# EAGLE design typewriter_shift (EAGLE 7.2.0)
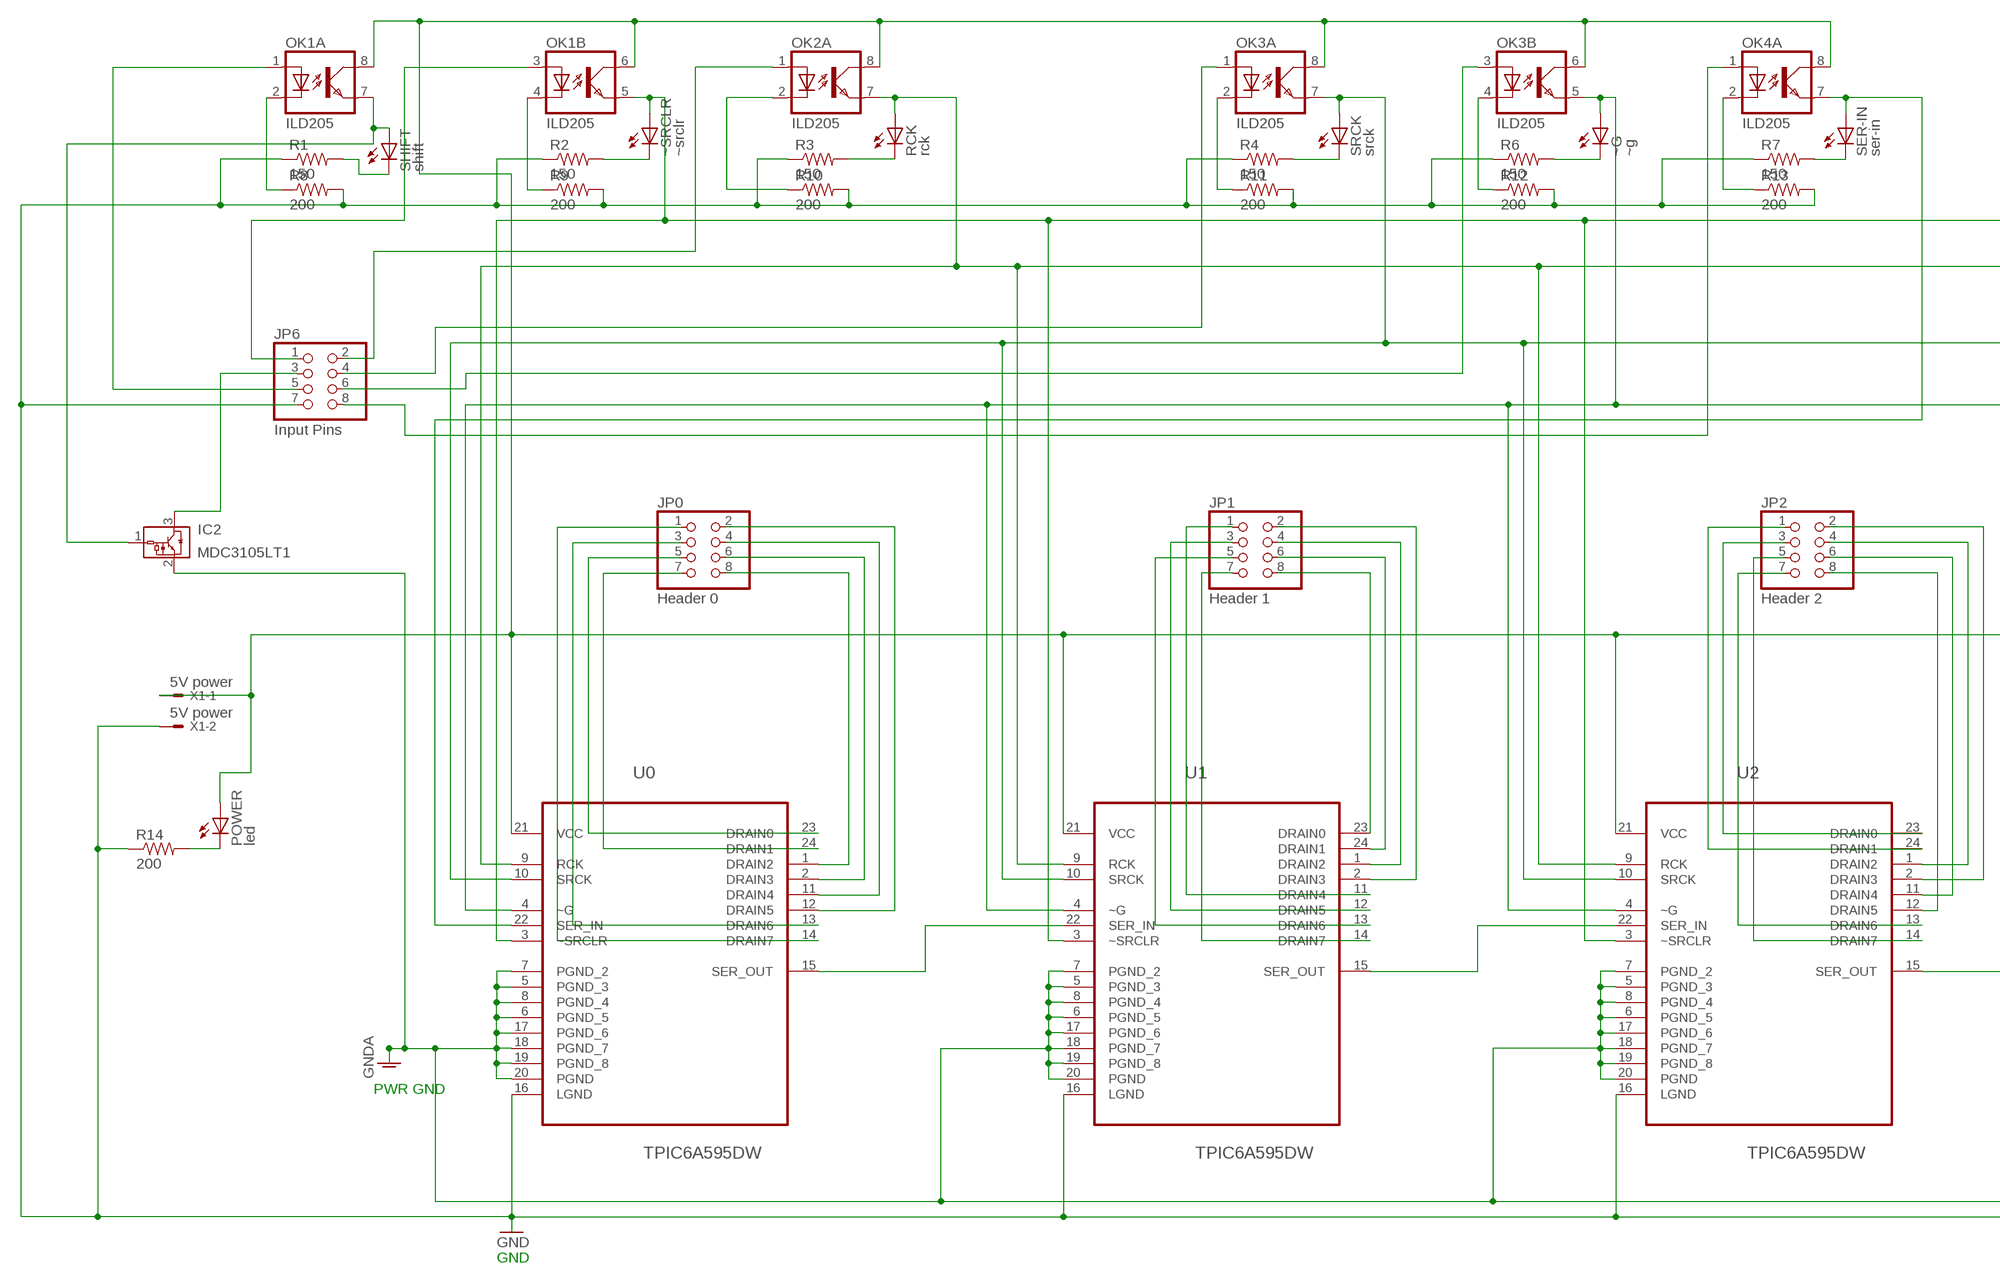
[diagram p0: schematic, sheet 1, part 1 of 2]
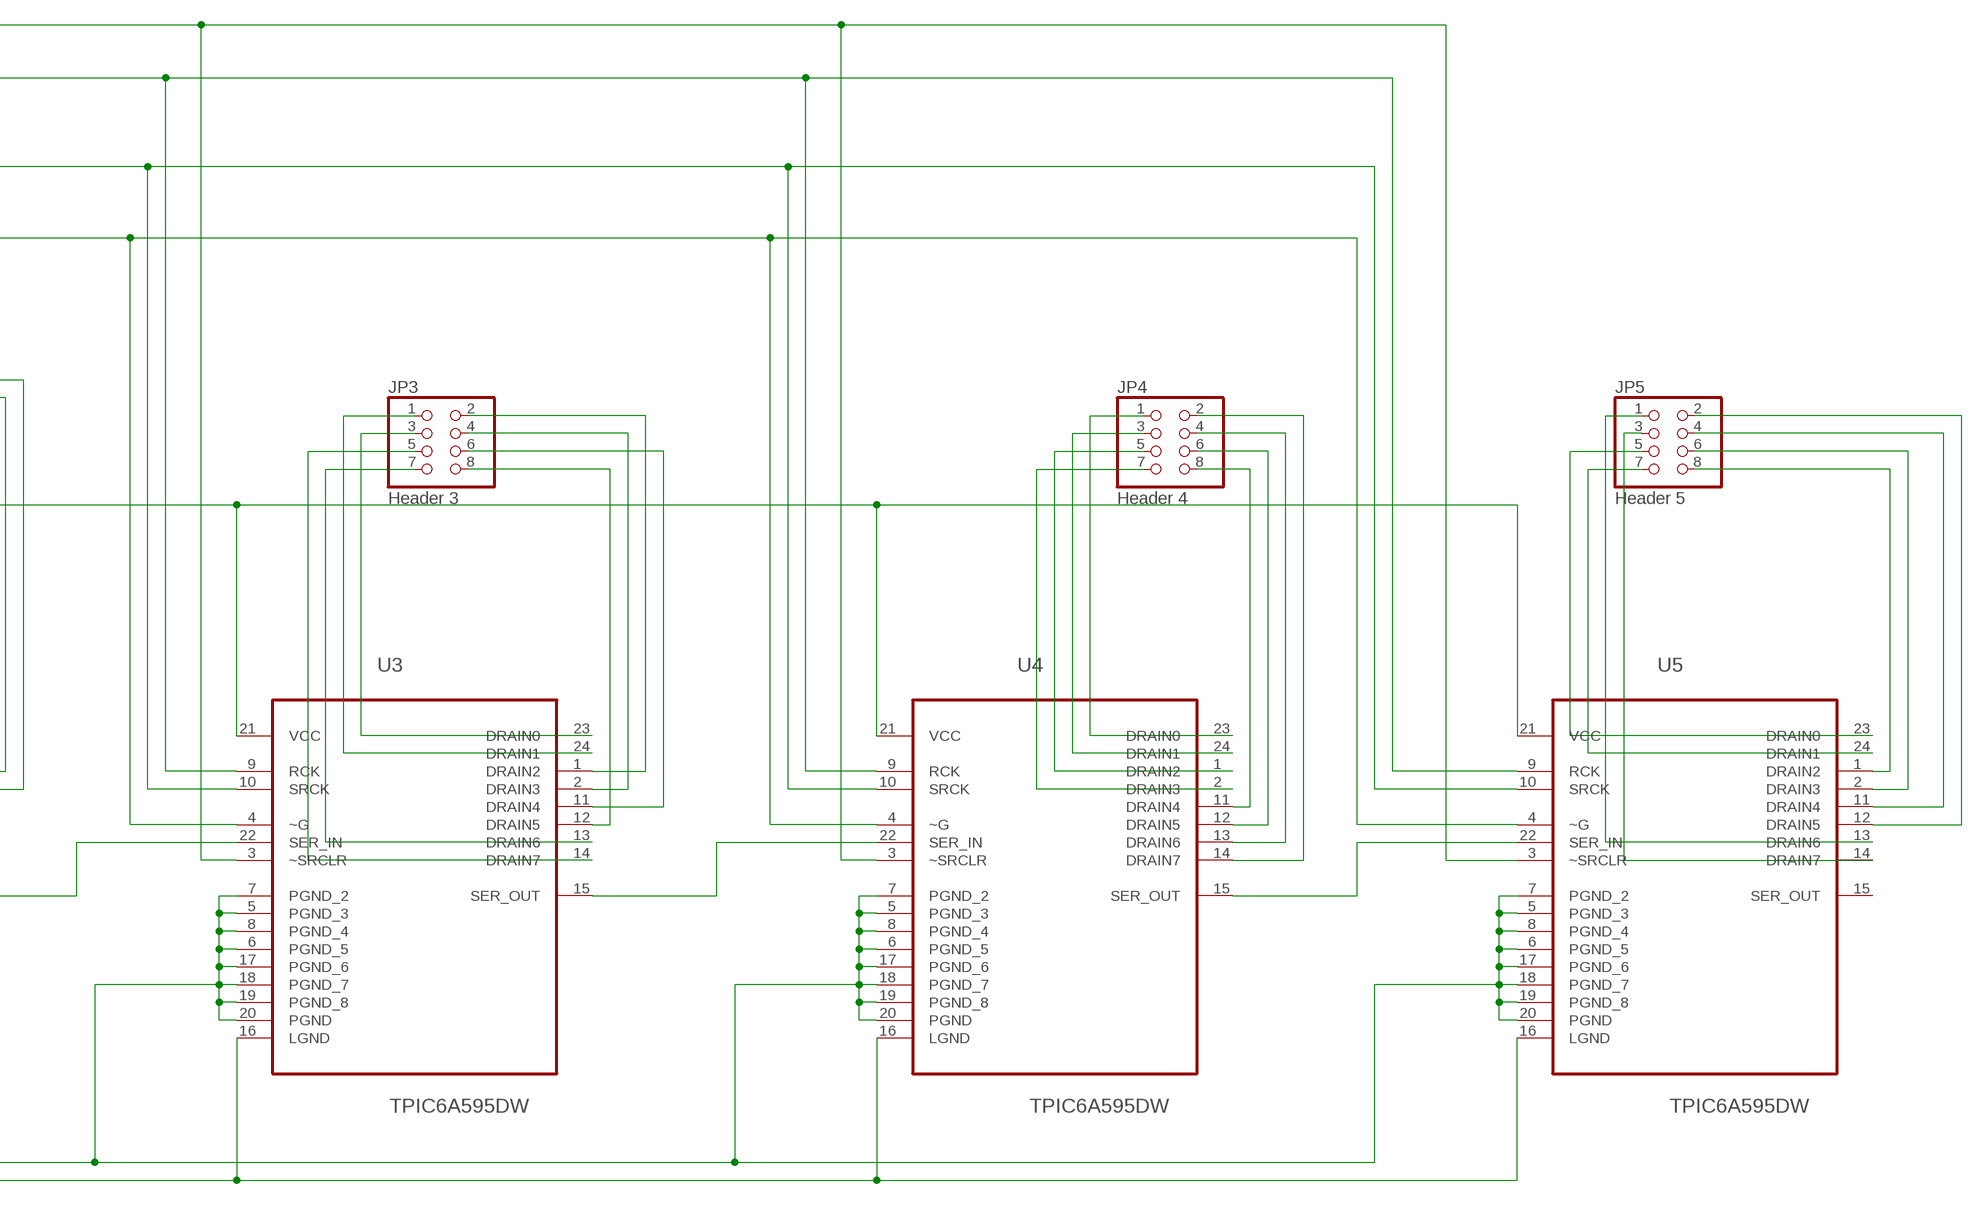
[diagram p1: schematic, sheet 1, part 2 of 2]

## Parts
IC2  MDC3105LT1  [SOT23]
JP0  Header 0  PINHD-2X4/90  [2X04/90]
JP1  Header 1  PINHD-2X4/90  [2X04/90]
JP2  Header 2  PINHD-2X4/90  [2X04/90]
JP3  Header 3  PINHD-2X4/90  [2X04/90]
JP4  Header 4  PINHD-2X4/90  [2X04/90]
JP5  Header 5  PINHD-2X4/90  [2X04/90]
JP6  Input Pins  PINHD-2X4/90  [2X04/90]
OK1  ILD205  [SOIC08]
OK2  ILD205  [SOIC08]
OK3  ILD205  [SOIC08]
OK4  ILD205  [SOIC08]
POWER  led  LEDSML1206  [SML1206]
R1  150  R-US_R1206  [R1206]
R2  150  R-US_R1206  [R1206]
R3  150  R-US_R1206  [R1206]
R4  150  R-US_R1206  [R1206]
R6  150  R-US_R1206  [R1206]
R7  150  R-US_R1206  [R1206]
R8  200  R-US_R1206  [R1206]
R9  200  R-US_R1206  [R1206]
R10  200  R-US_R1206  [R1206]
R11  200  R-US_R1206  [R1206]
R12  200  R-US_R1206  [R1206]
R13  200  R-US_R1206  [R1206]
R14  200  R-US_R1206  [R1206]
RCK  rck  LEDSML1206  [SML1206]
SER-IN  ser-in  LEDSML1206  [SML1206]
SHIFT  shift  LEDSML1206  [SML1206]
SRCK  srck  LEDSML1206  [SML1206]
U0  TPIC6A595DW  [SOIC127P1030X265-24N]
U1  TPIC6A595DW  [SOIC127P1030X265-24N]
U2  TPIC6A595DW  [SOIC127P1030X265-24N]
U3  TPIC6A595DW  [SOIC127P1030X265-24N]
U4  TPIC6A595DW  [SOIC127P1030X265-24N]
U5  TPIC6A595DW  [SOIC127P1030X265-24N]
X1  5V power  KK-156-2  [KK-156-2]
~G  ~g  LEDSML1206  [SML1206]
~SRCLR  ~srclr  LEDSML1206  [SML1206]

## Nets
GND: JP6.7 R1.1 R2.1 R3.1 R4.1 R6.1 R7.1 R8.2 R9.2 R10.2 R11.2 R12.2 R13.2 R14.1 U0.16(LGND) U1.16(LGND) U2.16(LGND) U3.16(LGND) U4.16(LGND) U5.16(LGND) X1.2
GNDA [PWR Ground]: IC2.2(GND) U0.5(PGND_3) U0.6(PGND_5) U0.7(PGND_2) U0.8(PGND_4) U0.17(PGND_6) U0.18(PGND_7) U0.19(PGND_8) U0.20(PGND) U1.5(PGND_3) U1.6(PGND_5) U1.7(PGND_2) U1.8(PGND_4) U1.17(PGND_6) U1.18(PGND_7) U1.19(PGND_8) U1.20(PGND) U2.5(PGND_3) U2.6(PGND_5) U2.7(PGND_2) U2.8(PGND_4) U2.17(PGND_6) U2.18(PGND_7) U2.19(PGND_8) U2.20(PGND) U3.5(PGND_3) U3.6(PGND_5) U3.7(PGND_2) U3.8(PGND_4) U3.17(PGND_6) U3.18(PGND_7) U3.19(PGND_8) U3.20(PGND) U4.5(PGND_3) U4.6(PGND_5) U4.7(PGND_2) U4.8(PGND_4) U4.17(PGND_6) U4.18(PGND_7) U4.19(PGND_8) U4.20(PGND) U5.5(PGND_3) U5.6(PGND_5) U5.7(PGND_2) U5.8(PGND_4) U5.17(PGND_6) U5.18(PGND_7) U5.19(PGND_8) U5.20(PGND)
N$1: U0.15(SER_OUT) U1.22(SER_IN)
N$2: U1.15(SER_OUT) U2.22(SER_IN)
N$3: U2.15(SER_OUT) U3.22(SER_IN)
N$4: U3.15(SER_OUT) U4.22(SER_IN)
N$5: U4.15(SER_OUT) U5.22(SER_IN)
N$6: R3.2 RCK.C
N$7: OK4.7(A:EMIT) SER-IN.A U0.22(SER_IN)
N$8: R2.2 ~SRCLR.C
N$9 [PWR Ground]: JP0.7 U0.24(DRAIN1)
N$11: JP6.5 OK1.1(A:A)
N$12 [PWR Ground]: JP0.5 U0.23(DRAIN0)
N$13 [PWR Ground]: JP0.8 U0.1(DRAIN2)
N$14 [PWR Ground]: JP0.6 U0.2(DRAIN3)
N$15 [PWR Ground]: IC2.3(VOUT) JP6.3
N$16: IC2.1(VIN) OK1.7(A:EMIT) SHIFT.A
N$17: OK1.2(A:C) R8.1
N$18 [PWR Ground]: JP0.4 U0.11(DRAIN4)
N$19 [PWR Ground]: JP0.2 U0.12(DRAIN5)
N$20: JP6.1 OK1.3(B:A)
N$21 [PWR Ground]: JP0.3 U0.13(DRAIN6)
N$22 [PWR Ground]: JP0.1 U0.14(DRAIN7)
N$23: JP6.2 OK2.1(A:A)
N$24 [PWR Ground]: JP1.4 U1.1(DRAIN2)
N$25 [PWR Ground]: JP1.6 U1.24(DRAIN1)
N$26 [PWR Ground]: JP1.8 U1.23(DRAIN0)
N$27 [PWR Ground]: JP1.2 U1.2(DRAIN3)
N$28 [PWR Ground]: JP1.1 U1.11(DRAIN4)
N$29: JP6.4 OK3.1(A:A)
N$30: JP6.8 OK4.1(A:A)
N$31: JP6.6 OK3.3(B:A)
N$32: OK3.4(B:C) R12.1
N$33: JP1.7 U1.14(DRAIN7)
N$34 [PWR Ground]: JP1.3 U1.12(DRAIN5)
N$35 [PWR Ground]: JP1.5 U1.13(DRAIN6)
N$36 [PWR Ground]: JP3.3 U3.23(DRAIN0)
N$37 [PWR Ground]: JP2.6 U2.11(DRAIN4)
N$38 [PWR Ground]: JP2.4 U2.1(DRAIN2)
N$39: JP2.2 U2.2(DRAIN3)
N$40 [PWR Ground]: JP2.5 U2.14(DRAIN7)
N$41 [PWR Ground]: JP2.7 U2.13(DRAIN6)
N$42: JP2.3 U2.23(DRAIN0)
N$43 [PWR Ground]: JP2.1 U2.24(DRAIN1)
N$44 [PWR Ground]: JP2.8 U2.12(DRAIN5)
N$45 [PWR Ground]: JP3.1 U3.24(DRAIN1)
N$46 [PWR Ground]: JP3.2 U3.1(DRAIN2)
N$47 [PWR Ground]: JP3.4 U3.2(DRAIN3)
N$48 [PWR Ground]: JP3.6 U3.11(DRAIN4)
N$49 [PWR Ground]: JP3.8 U3.12(DRAIN5)
N$50 [PWR Ground]: JP3.7 U3.13(DRAIN6)
N$51 [PWR Ground]: JP3.5 U3.14(DRAIN7)
N$52 [PWR Ground]: JP4.1 U4.23(DRAIN0)
N$53 [PWR Ground]: JP4.3 U4.24(DRAIN1)
N$54 [PWR Ground]: JP4.5 U4.1(DRAIN2)
N$55 [PWR Ground]: JP4.7 U4.2(DRAIN3)
N$56 [PWR Ground]: JP4.8 U4.11(DRAIN4)
N$57 [PWR Ground]: JP4.6 U4.12(DRAIN5)
N$58 [PWR Ground]: JP4.4 U4.13(DRAIN6)
N$59 [PWR Ground]: JP4.2 U4.14(DRAIN7)
N$60 [PWR Ground]: JP5.5 U5.23(DRAIN0)
N$61 [PWR Ground]: JP5.7 U5.24(DRAIN1)
N$62 [PWR Ground]: JP5.8 U5.1(DRAIN2)
N$63 [PWR Ground]: JP5.6 U5.2(DRAIN3)
N$64 [PWR Ground]: JP5.4 U5.11(DRAIN4)
N$65 [PWR Ground]: JP5.2 U5.12(DRAIN5)
N$66 [PWR Ground]: JP5.1 U5.13(DRAIN6)
N$67: JP5.3 U5.14(DRAIN7)
N$68: OK3.5(B:EMIT) U0.4(~G) U1.4(~G) U2.4(~G) U3.4(~G) U4.4(~G) U5.4(~G) ~G.A
N$69: OK3.7(A:EMIT) SRCK.A U0.10(SRCK) U1.10(SRCK) U2.10(SRCK) U3.10(SRCK) U4.10(SRCK) U5.10(SRCK)
N$70: OK2.7(A:EMIT) RCK.A U0.9(RCK) U1.9(RCK) U2.9(RCK) U3.9(RCK) U4.9(RCK) U5.9(RCK)
N$71: OK1.5(B:EMIT) U0.3(~SRCLR) U1.3(~SRCLR) U2.3(~SRCLR) U3.3(~SRCLR) U4.3(~SRCLR) U5.3(~SRCLR) ~SRCLR.A
N$72: OK4.2(A:C) R13.1
N$73: R1.2 SHIFT.C
N$74: R4.2 SRCK.C
N$75: R6.2 ~G.C
N$76: OK3.2(A:C) R11.1
N$77: OK2.2(A:C) R10.1
N$78: OK1.4(B:C) R9.1
N$79: R7.2 SER-IN.C
N$80: POWER.C R14.2
VCC: OK1.6(B:COL) OK1.8(A:COL) OK2.8(A:COL) OK3.6(B:COL) OK3.8(A:COL) OK4.8(A:COL) POWER.A U0.21(VCC) U1.21(VCC) U2.21(VCC) U3.21(VCC) U4.21(VCC) U5.21(VCC) X1.1
Unconnected: OK2.3(B:A) OK2.4(B:C) OK2.5(B:EMIT) OK2.6(B:COL) OK4.3(B:A) OK4.4(B:C) OK4.5(B:EMIT) OK4.6(B:COL) U5.15(SER_OUT)

## Notes on the sheet
- PWR GND
- GND

## Library data of the parts
IC2 = on-semiconductor:MDC3105LT1: Integrated Relay, Inductive Load Driver Sopurce: U6 OnSemi Inductive Load Driver MDC3105-D.PDF; MF: ON SEMICONDUCTOR; MPN: MDC3105LT1; OC_FARNELL: 1126459; OC_NEWARK: 16F6132
JP0 JP1-JP6 = pinhead:PINHD-2X4: PIN HEADER
OK1-OK4 = optocoupler:ILD2*: Siemens ILD205/206/207/211/213/217 DUAL PHOTOTRANSISTOR SMALL OUTLINE SURFACE MOUNT OPTOCOUPLER Source: 153385-da-01-en-Optocoupler_ILD205-T.pdf; MF: VISHAY/TELEFUNKEN; MPN: ILD205T; OC_FARNELL: 1469512; OC_NEWARK: 20H8678
POWER RCK SER-IN SHIFT SRCK ~G ~SRCLR = led:LED: LED OSRAM: - CHIPLED LG R971, LG N971, LY N971, LG Q971, LY Q971, LO R971, LY R971 LH N974, LH R974 LS Q976, LO Q976, LY Q976 LO Q996 - Hyper CHIPLED LW Q18S LB Q993, LB Q99A, LB R99A - SideLED LS A670, LO A670, LY A670, LG A670, LP A670 LB A673, LV A673, LT A673, LW A673 LH A674 LY A675 LS A676, LA A676, LO A676, LY A676, LW A676 LS A679, LY A679, LG A679 - Hyper Micro SIDELED® LS Y876, LA Y876, LO Y876, LY Y876 LT Y87S - SmartLED LW L88C, LW L88S LB L89C, LB L89S, LG L890 LS L89K, LO L89K, LY L89K LS L896, LA L896, LO L896, LY L896 - TOPLED LS T670, LO T670, LY T670, LG T670, LP T670 LSG T670, LSP T670, LSY T670, LOP T670, LYG T670 LG T671, LOG T671, LSG T671 LB T673, LV T673, LT T673, LW T673 LH T674 LS T676, LA T676, LO T676, LY T676, LB T676, LH T676, LSB T676, LW T676 LB T67C, LV T67C, LT T67C, LS T67K, LO T67K, LY T67K, LW E67C LS E67B, LA E67B, LO E67B, LY E67B, LB E67C, LV E67C, LT E67C LW T67C LS T679, LY T679, LG T679 LS T770, LO T770, LY T770, LG T770, LP T770 LB T773, LV T773, LT T773, LW T773 LH T774 LS E675, LA E675, LY E675, LS T675 LS T776, LA T776, LO T776, LY T776, LB T776 LHGB T686 LT T68C, LB T68C - Hyper Mini TOPLED® LB M676 - Mini TOPLED Santana® LG M470 LS M47K, LO M47K, LY M47K Source: http://www.osram.convergy.de LUXEON: - LUMILED® LXK2-PW12-R00, LXK2-PW12-S00, LXK2-PW14-U00, LXK2-PW14-V00 LXK2-PM12-R00, LXK2-PM12-S00, LXK2-PM14-U00 LXK2-PE12-Q00, LXK2-PE12-R00, LXK2-PE12-S00, LXK2-PE14-T00, LXK2-PE14-U00 LXK2-PB12-K00, LXK2-PB12-L00, LXK2-PB12-M00, LXK2-PB14-N00, LXK2-PB14-P00, LXK2-PB14-Q00 LXK2-PR12-L00, LXK2-PR12-M00, LXK2-PR14-Q00, LXK2-PR14-R00 LXK2-PD12-Q00, LXK2-PD12-R00, LXK2-PD12-S00 LXK2-PH12-R00, LXK2-PH12-S00 LXK2-PL12-P00, LXK2-PL12-Q00, LXK2-PL12-R00 Source: www.luxeon.com KINGBRIGHT: KA-3528ASYC Source: www.kingbright.com
R1-R4 R6-R14 = resistor:R-US_: RESISTOR, American symbol
U0 U1-U5 = Texas Instruments_By_element14_Batch_1:TPIC6A595DW: POWER LOGIC 8-BIT SHIFT REGISTER; MPN: TPIC6A595DW; OC_FARNELL: -; OC_NEWARK: 83F9188; PACKAGE: SOIC-24; SUPPLIER: Texas Instruments
X1 = con-molex:KK-156-2: KK 156 HEADER Source: http://www.molex.com/pdm_docs/sd/026604100_sd.pdf; OC_FARNELL: unknown; OC_NEWARK: unknown

## Net classes
1 PWR Ground: width 0.61 mm, drill 0.61 mm

## Board
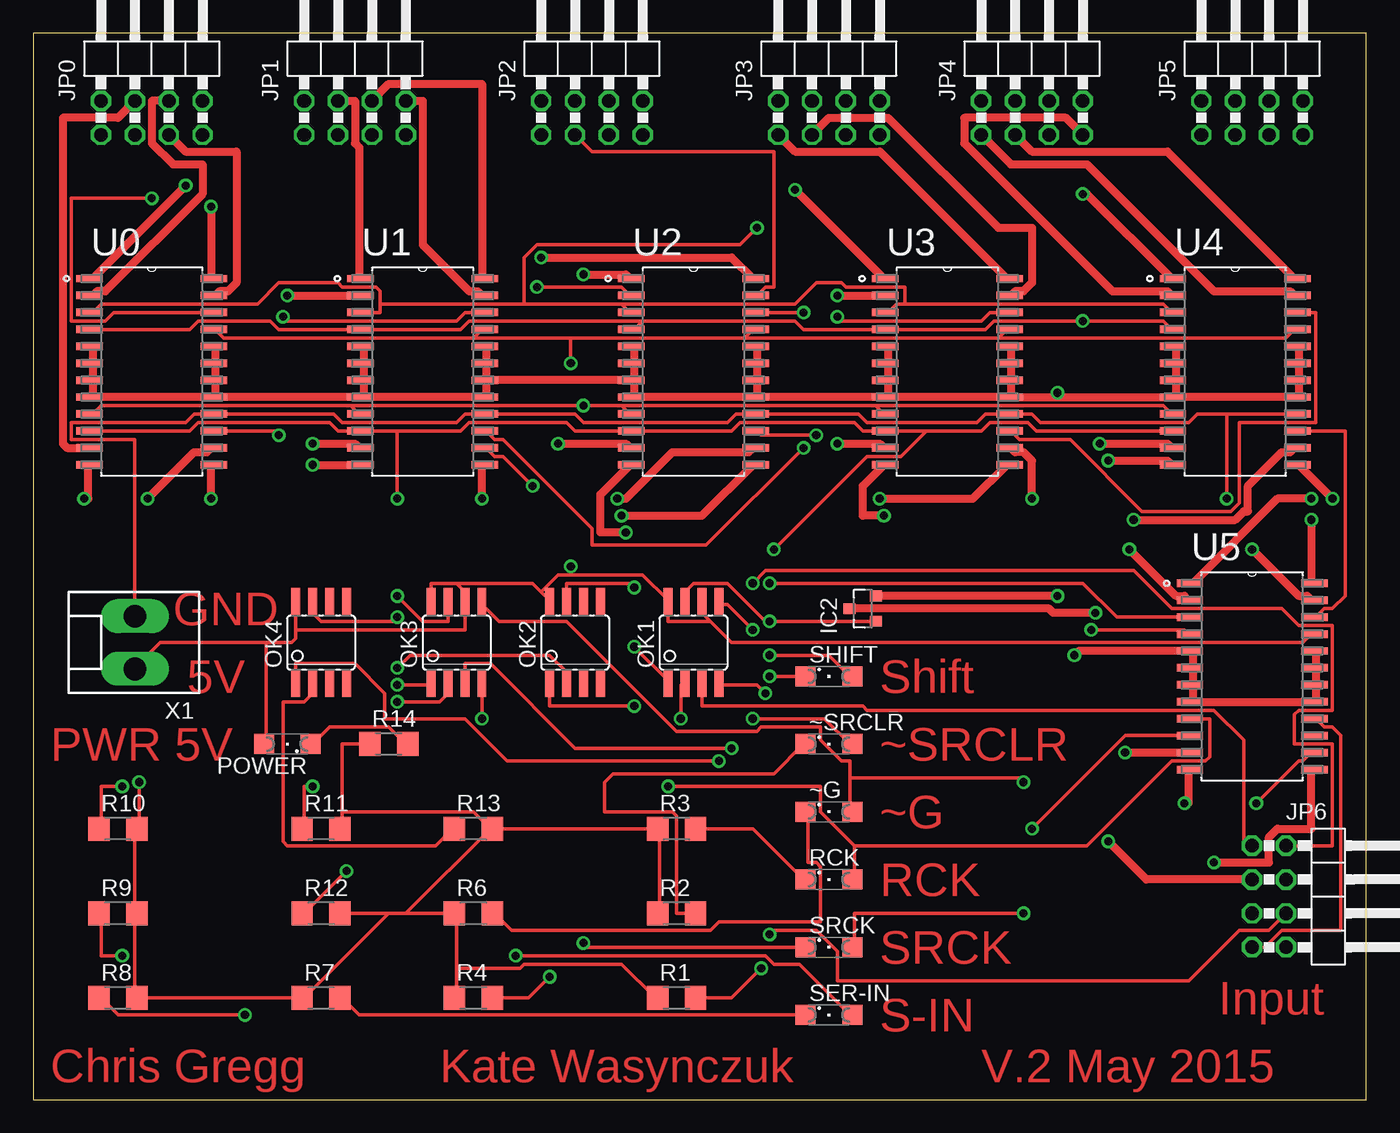
[diagram p2: board, top side]
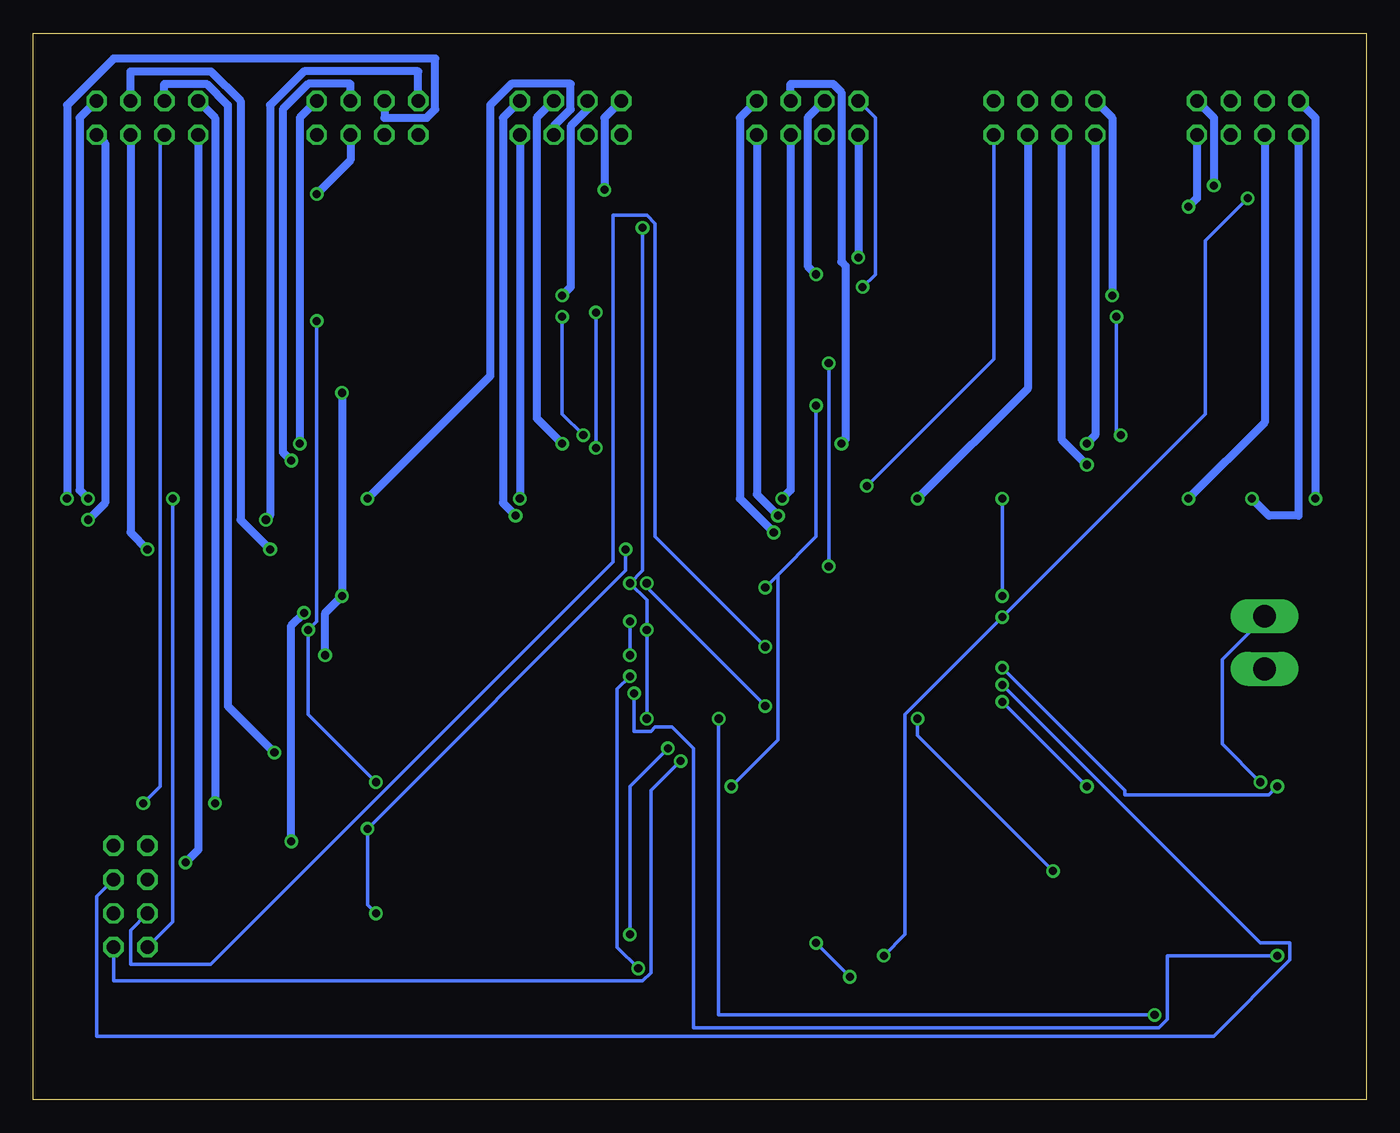
[diagram p3: board, bottom side, seen from below]

Size 100 x 80 mm. Coordinates in mm from the lower left corner, seen from the top.
Outline: 0,0 100,0 100,80 0,80 0,0
Copper layers (1*16): Top 0.035mm / dielectric 1.5mm / Bottom 0.035mm
Design rules "default": minimum track width 10mil, minimum drill 24mil, track to track 8mil, track to pad 8mil, pad to pad 8mil, via to via 8mil, smd to smd 8mil, copper to edge 40mil, drill to drill 8mil, minimum pad ring 10mil, minimum via ring 8mil, stop-mask expansion 4mil, vias tented up to drill 0mil, thermal gap 10mil
vRestrict: area 1.3,45.7 to 16.5,63.5; area 21.6,45.7 to 36.8,63.5; area 41.9,45.7 to 57.2,63.5; area 61,45.7 to 76.2,63.5; area 81.3,45.7 to 97.8,63.5; area 82.6,22.9 to 99.1,40.6; area 55.9,5.1 to 73.7,39.4; area 1.3,17.8 to 11.4,22.9; area 1.3,11.4 to 11.4,16.5; area 1.3,5.1 to 11.4,10.2; area 16.5,5.1 to 26.7,10.2; area 16.5,11.4 to 26.7,16.5; 12 more areas

### Footprints (pad centres in the part's own frame; a part is rotated, then mirrored left to right if it is on the bottom)
SOT23 = smd 0.8 x 0.9: 1 -0.95,-1; 2 0.95,-1; 3 0,1
2X04/90 = drill 1.016 octagon: 1 -3.81,-6.35; 2 -3.81,-3.81; 3 -1.27,-6.35; 4 -1.27,-3.81; 5 1.27,-6.35; 6 1.27,-3.81; 7 3.81,-6.35; 8 3.81,-3.81
SOIC08 = smd 0.66 x 2.032: 1 -1.905,-3.073; 2 -0.635,-3.073; 3 0.635,-3.073; 4 1.905,-3.073; 5 1.905,3.073; 6 0.635,3.073; 7 -0.635,3.073; 8 -1.905,3.073
SML1206 = smd 1.5 x 1.5: A 1.75,0; C -1.75,0
R1206 = smd 1.6 x 1.803: 1 -1.422,0; 2 1.422,0
SOIC127P1030X265-24N = smd 1.981 x 0.559: 1 -4.674,6.985; 2 -4.674,5.715; 3 -4.674,4.445; 4 -4.674,3.175; 5 -4.674,1.905; 6 -4.674,0.635; 7 -4.674,-0.635; 8 -4.674,-1.905; 9 -4.674,-3.175; 10 -4.674,-4.445; 11 -4.674,-5.715; 12 -4.674,-6.985; 13 4.674,-6.985; 14 4.674,-5.715; 15 4.674,-4.445; 16 4.674,-3.175; 17 4.674,-1.905; 18 4.674,-0.635; 19 4.674,0.635; 20 4.674,1.905; 21 4.674,3.175; 22 4.674,4.445; 23 4.674,5.715; 24 4.674,6.985
KK-156-2 = drill 1.7 pad 2.184 long: 1 -1.98,0; 2 1.98,0

### Placement (x,y rotation side)
IC2  62.23,36.83 90 top
JP0  8.89,78.74 0 top
JP1  24.13,78.74 0 top
JP2  41.91,78.74 0 top
JP3  59.69,78.74 0 top
JP4  74.93,78.74 0 top
JP5  91.44,78.74 0 top
JP6  97.79,15.24 270 top
OK1  49.53,34.29 0 top
OK2  40.64,34.29 0 top
OK3  31.75,34.29 0 top
OK4  21.59,34.29 0 top
POWER  19.05,26.67 180 top
R1  48.26,7.62 0 top
R2  48.26,13.97 0 top
R3  48.26,20.32 0 top
R4  33.02,7.62 0 top
R6  33.02,13.97 0 top
R7  21.59,7.62 0 top
R8  6.35,7.62 0 top
R9  6.35,13.97 0 top
R10  6.35,20.32 0 top
R11  21.59,20.32 0 top
R12  21.59,13.97 0 top
R13  33.02,20.32 0 top
R14  26.67,26.67 0 top
RCK  59.69,16.51 0 top
SER-IN  59.69,6.35 0 top
SHIFT  59.69,31.75 0 top
SRCK  59.69,11.43 0 top
U0  8.89,54.61 0 top
U1  29.21,54.61 0 top
U2  49.53,54.61 0 top
U3  68.58,54.61 0 top
U4  90.17,54.61 0 top
U5  91.44,31.75 0 top
X1  7.62,34.29 90 top
~G  59.69,21.59 0 top
~SRCLR  59.69,26.67 0 top

### Tracks (layer width: path | path; a pad name or v marks a point on that pad's centre or on a via)
GND  (via drill 0.61)
  Top 0.254: 7.62,13.97 7.62,7.62 R8.2 R7.1 20.32,7.62 26.67,13.97 | 7.62,13.97 7.62,20.32 R10.2 7.94,20.32 v7.94,23.81 | 7.62,13.97 R9.2 | 23.18,21.59 23.18,26.67 R14.1 | 23.18,21.59 23.18,20.32 R11.2 | R2.1 46.99,13.97 46.99,20.32 R3.1 R13.2 34.29,20.32 | 31.75,9.84 31.75,13.97 R6.1 27.94,13.97 | 31.75,9.84 31.75,7.62 R4.1 | 31.75,9.84 36.51,9.84 36.83,10.16 44.13,10.16 46.67,7.62 R1.1 | 27.94,13.97 26.67,13.97 | 26.67,13.97 R12.2 | 27.94,13.97 34.29,20.32 | 23.18,21.59 33.02,21.59 34.29,20.32 | X1.2 7.62,49.53 2.86,49.53 2.86,50.8 11.43,50.8 12.06,51.44 U0.16 22.54,51.44 23.18,50.8 31.75,50.8 32.38,51.44 U1.16 40.64,51.44 41.27,50.8 52.07,50.8 52.7,51.44 U2.16 61.91,51.44 62.55,50.8 70.8,50.8 71.44,51.44 U3.16 74.93,51.44 75.56,50.8 86.68,50.8 87.31,51.44 89.53,51.44 | JP6.7 92.39,11.43 93.66,12.7 98.11,12.7 98.11,27.3 97.47,27.94 96.84,27.94 96.2,28.57 U5.16 | 89.53,51.44 U4.16 | 89.53,51.44 v89.53,45.09
  Bottom 0.254: JP6.7 89.53,13.34 v89.53,45.09 | v7.94,23.81 10.79,26.67 10.79,33.02 7.62,36.2 X1.2
GNDA  (via drill 0.61)
  Top 0.61: 96.2,31.11 96.2,29.84 U5.17 87,29.84 | 96.2,32.38 96.2,33.66 U5.20 | 96.2,32.38 96.2,31.11 | 96.2,31.11 U5.18 | 96.2,32.38 U5.19 | 87,31.11 87,29.84 | v76.83,37.78 63.5,37.78 IC2.2 | v78.11,33.34 78.42,33.66 U5.5 87,33.66 87,32.38 | 87,32.38 87,31.11 | 87,31.11 U5.7 | 87,32.38 U5.6 | 87,29.84 U5.8 | 4.45,53.98 4.45,52.7 | 4.45,55.24 4.45,56.52 U0.5 | 4.45,55.24 4.45,53.98 | 4.45,53.98 U0.7 | 4.45,55.24 U0.6 | 13.65,53.98 13.65,52.7 | 13.65,55.24 13.65,56.52 U0.20 | 13.65,55.24 13.65,53.98 | 13.65,53.98 U0.18 | 13.65,55.24 U0.19 | 4.45,52.7 U0.17 13.65,52.7 | 4.45,52.7 U0.8 | 24.77,53.98 24.77,52.7 | 24.77,55.24 24.77,56.52 U1.5 | 24.77,55.24 24.77,53.98 | 24.77,53.98 U1.7 | 24.77,55.24 U1.6 | 33.97,53.98 33.97,52.7 U1.17 24.77,52.7 | 33.97,55.24 33.97,56.52 U1.20 | 33.97,55.24 33.97,53.98 | 33.97,55.24 U1.19 | 24.77,52.7 U1.8 13.65,52.7 | 85.72,53.98 85.72,52.7 | 85.72,55.24 85.72,56.52 U4.5 | 85.72,55.24 85.72,53.98 | 85.72,53.98 U4.7 | 85.72,55.24 U4.6 | 94.93,53.98 94.93,52.7 U4.17 85.72,52.7 | 94.93,55.24 94.93,56.52 U4.20 | 94.93,55.24 94.93,53.98 | 94.93,53.98 U4.18 | 94.93,55.24 U4.19 | 85.72,52.7 U4.8 76.83,52.7 | 45.09,53.98 45.09,52.7 | 45.09,55.24 45.09,56.52 U2.5 | 45.09,55.24 45.09,53.98 | 45.09,53.98 U2.7 33.97,53.98 | 45.09,55.24 U2.6 | 54.29,53.98 54.29,52.7 | 54.29,55.24 54.29,56.52 U2.20 | 54.29,55.24 54.29,53.98 | 54.29,53.98 U2.18 | 54.29,55.24 U2.19 | 45.09,52.7 U2.17 54.29,52.7 | 45.09,52.7 U2.8 | 64.14,53.98 64.14,52.7 | 64.14,55.24 64.14,56.52 U3.5 | 64.14,55.24 64.14,53.98 | 64.14,53.98 U3.7 | 64.14,55.24 U3.6 | 73.34,53.98 73.34,52.7 | 73.34,55.24 73.34,56.52 U3.20 | 73.34,55.24 73.34,53.98 | 73.34,53.98 U3.18 | 73.34,55.24 U3.19 | 64.14,52.7 U3.17 73.34,52.7
  Top 0.61: 64.14,52.7 U3.8 54.29,52.7 | 73.34,52.7 76.83,52.7 | 33.97,53.98 U1.18 | 76.83,52.7 v76.83,53.02
  Bottom 0.61: v78.11,33.34 78.11,36.51 v76.83,37.78 v76.83,53.02
N$1  (via drill 0.61)
  Top 0.254: U0.15 18.1,50.16 v18.41,49.85 | v18.73,58.74 19.05,58.42 31.75,58.42 32.38,59.05 U1.22
  Bottom 0.254: v18.41,49.85 18.73,50.16 v18.73,58.74
N$2  (via drill 0.61)
  Top 0.254: v57.78,48.9 50.48,41.59 41.91,41.59 41.91,42.86 35.24,49.53 34.61,49.53 33.97,50.16 U1.15 | U2.22 v57.78,59.05
  Bottom 0.254: v57.78,59.05 v57.78,48.9
N$3  (via drill 0.61)
  Top 0.254: v58.74,49.85 54.61,49.85 54.29,50.16 U2.15 | v60.33,58.74 60.64,58.42 71.12,58.42 71.75,59.05 U3.22
  Bottom 0.254: v58.74,49.85 60.33,51.44 v60.33,58.74
N$4
  Top 0.254: U4.22 96.2,59.05 96.2,50.8 90.49,50.8 90.49,44.77 89.85,44.13 83.19,44.13 77.79,49.53 73.98,49.53 73.34,50.16 U3.15
N$5
  Top 0.254: U4.15 98.42,50.16 98.42,37.78 97.47,36.83 96.84,36.83 96.2,36.2 U5.22
N$6
  Top 0.254: R3.2 53.98,20.32 57.78,16.51 RCK.C
N$7  (via drill 0.61)
  Top 0.254: v36.2,10.79 54.93,10.79 55.56,10.16 57.47,10.16 61.28,6.35 SER-IN.A | v27.3,36.2 26.99,35.88 21.59,35.88 20.95,36.51 OK4.7 | U0.22 6.03,59.05 5.4,58.42 2.86,58.42 2.86,67.63 v8.89,67.63
  Bottom 0.254: v36.2,10.79 34.61,12.38 34.61,28.89 v27.3,36.2 12.06,51.44 12.06,64.45 v8.89,67.63
N$8
  Top 0.254: R2.2 48.26,13.97 48.26,21.27 47.94,21.59 42.86,21.59 42.86,23.81 43.5,24.45 55.56,24.45 57.78,26.67 ~SRCLR.C
N$9  (via drill 0.61)
  Top 0.61: v13.34,66.99 13.34,61.59 U0.24
  Bottom 0.61: v13.34,66.99 12.7,67.63 JP0.7
N$11  (via drill 0.61)
  Top 0.254: v45.09,33.97 47.62,31.43 OK1.1
  Bottom 0.254: v45.09,33.97 53.34,42.23 53.34,65.72 53.98,66.36 56.52,66.36 56.52,40.32 86.68,10.16 92.71,10.16 92.71,12.7 JP6.5
N$12
  Top 0.61: JP0.5 11.43,71.12 15.24,71.12 15.24,61.28 14.61,60.64 13.97,60.64 13.65,60.33 U0.23
N$13  (via drill 0.61)
  Top 0.61: v11.43,68.58 4.45,61.59 U0.1
  Bottom 0.61: v11.43,68.58 11.43,73.66 JP0.8
N$14
  Top 0.61: JP0.6 8.89,74.93 8.89,71.75 10.48,70.17 12.7,70.17 12.7,67.94 5.4,60.64 4.76,60.64 4.45,60.33 U0.2
N$15  (via drill 0.61)
  Top 0.61: IC2.3 76.2,36.83 76.52,36.51 v79.69,36.51 | v80.64,19.37 83.5,16.51 JP6.3
  Bottom 0.61: v79.69,36.51 80.64,35.56 v80.64,19.37
N$16  (via drill 0.61)
  Top 0.254: OK1.7 48.9,38.1 49.53,38.73 52.07,38.73 54.93,35.88 v55.24,35.88 63.18,35.88 IC2.1 | v55.24,33.34 59.69,33.34 61.28,31.75 SHIFT.A
  Bottom 0.254: v55.24,35.88 v55.24,33.34
N$17  (via drill 0.61)
  Top 0.254: v15.88,6.35 6.35,6.35 5.08,7.62 R8.1 | v48.58,28.57 48.58,31.11 48.9,31.11 OK1.2
  Bottom 0.254: v15.88,6.35 48.58,6.35 v48.58,28.57
N$18
  Top 0.61: U0.11 2.54,48.9 2.22,49.21 2.22,73.66 6.35,73.66 JP0.4
N$19  (via drill 0.61)
  Top 0.61: v3.81,45.09 4.13,45.09 4.13,47.62 U0.12
  Bottom 0.61: v3.81,45.09 3.81,73.66 JP0.2
N$20
  Top 0.254: OK1.3 50.16,29.53 62.23,29.53 62.55,29.21 88.58,29.21 90.81,26.99 90.81,19.05 JP6.1
N$21  (via drill 0.61)
  Top 0.61: v13.34,45.09 13.34,47.62 U0.13
  Bottom 0.61: v13.34,45.09 7.62,50.8 JP0.3
N$22  (via drill 0.61)
  Top 0.61: v8.57,45.09 12.06,48.58 13.02,48.58 13.34,48.9 U0.14
  Bottom 0.61: v8.57,45.09 7.3,43.81 5.08,43.81 JP0.1
N$23  (via drill 0.61)
  Top 0.254: OK2.1 38.73,29.53 v45.09,29.53 | v53.98,38.73 54.93,39.69 82.55,39.69 85.41,36.83 93.66,36.83 94.93,35.56 97.47,35.56 97.47,29.21 94.93,29.21 94.61,28.89 94.61,26.67 97.47,26.67 97.47,19.05 JP6.2
  Bottom 0.254: v45.09,29.53 53.98,38.42 v53.98,38.73
N$24
  Top 0.61: JP1.4 24.13,74.93 24.13,71.75 24.45,71.44 24.45,61.59 U1.1
N$25
  Top 0.61: JP1.6 26.67,76.2 33.66,76.2 33.66,61.59 U1.24
N$26
  Top 0.61: JP1.8 29.21,74.93 29.21,64.14 32.7,60.64 33.34,60.64 33.66,60.33 U1.23
N$27  (via drill 0.61)
  Top 0.61: v19.05,60.33 U1.2
  Bottom 0.61: v19.05,60.33 19.05,73.66 JP1.2
N$28  (via drill 0.61)
  Top 0.61: v20.95,49.21 24.13,49.21 24.45,48.9 U1.11
  Bottom 0.61: v20.95,49.21 20.32,49.85 JP1.1
N$29  (via drill 0.61)
  Top 0.254: v27.3,31.11 29.84,31.11 OK3.1
  Bottom 0.254: v27.3,31.11 7.94,11.75 5.71,11.75 5.71,10.48 11.43,4.76 95.25,4.76 95.25,15.24 JP6.4
N$30  (via drill 0.61)
  Top 0.254: OK4.1 19.68,32.7 24.13,32.7 26.35,30.48 26.35,28.57 32.38,28.57 35.56,25.4 v51.44,25.4
  Bottom 0.254: v51.44,25.4 53.66,23.18 53.66,9.53 54.29,8.89 93.98,8.89 JP6.8
N$31  (via drill 0.61)
  Top 0.254: OK3.3 32.38,32.7 34.29,32.7 40.64,26.35 v52.39,26.35 | v55.24,12.38 55.56,12.7 58.74,12.7 60.33,11.11 60.33,8.89 86.68,8.89 90.49,12.7 92.71,12.7 JP6.6
  Bottom 0.254: v52.39,26.35 55.24,23.5 v55.24,12.38
N$32  (via drill 0.61)
  Top 0.254: v23.5,17.14 20.32,13.97 R12.1 | OK3.4 v33.66,28.57
  Bottom 0.254: v23.5,17.14 33.66,27.3 v33.66,28.57
N$33  (via drill 0.61)
  Top 0.254: v37.47,46.04 35.24,48.26 34.61,48.26 33.97,48.9 U1.14
  Bottom 0.254: v37.47,46.04 27.94,55.56 JP1.7
N$34  (via drill 0.61)
  Top 0.61: v20.95,47.62 U1.12
  Bottom 0.61: v20.95,47.62 22.86,49.53 JP1.3
N$35  (via drill 0.61)
  Top 0.61: v33.66,45.09 33.66,47.62 U1.13
  Bottom 0.61: v33.66,45.09 25.4,53.34 JP1.5
N$36
  Top 0.61: JP3.3 59.69,73.66 64.14,73.66 72.39,65.41 74.93,65.41 74.93,61.28 74.3,60.64 73.66,60.64 73.34,60.33 U3.23
N$37  (via drill 0.61)
  Top 0.61: v39.37,49.21 44.45,49.21 44.77,48.9 U2.11
  Bottom 0.61: v39.37,49.21 39.05,49.53 39.05,62.55 39.37,62.87 39.37,75.56 40.01,76.2 43.18,76.2 JP2.6
N$38  (via drill 0.61)
  Top 0.61: v41.27,61.91 44.45,61.91 44.77,61.59 U2.1
  Bottom 0.61: v41.27,61.91 41.91,62.55 41.91,73.66 JP2.4
N$39  (via drill 0.61)
  Top 0.254: v37.78,60.96 44.13,60.96 44.77,60.33 U2.2
  Bottom 0.254: v37.78,60.96 36.83,61.91 36.83,73.66 JP2.2
N$40  (via drill 0.61)
  Top 0.61: v43.81,45.09 44.45,45.09 47.94,48.58 53.66,48.58 53.98,48.9 U2.14
  Bottom 0.61: v43.81,45.09 43.18,45.72 JP2.5
N$41  (via drill 0.61)
  Top 0.61: v44.13,43.81 50.16,43.81 53.98,47.62 U2.13
  Bottom 0.61: v44.13,43.81 45.72,45.4 JP2.7
N$42
  Top 0.254: JP2.3 41.91,71.12 55.56,71.12 55.56,60.96 54.93,60.96 54.29,60.33 U2.23
N$43  (via drill 0.61)
  Top 0.61: v38.1,63.18 52.39,63.18 53.98,61.59 U2.24
  Bottom 0.61: JP2.1 v38.1,63.18
N$44  (via drill 0.61)
  Top 0.61: v44.45,42.55 42.55,42.55 42.55,45.4 44.77,47.62 U2.12
  Bottom 0.61: v44.45,42.55 46.99,45.09 46.99,73.66 JP2.8
N$45
  Top 0.61: JP3.1 57.15,71.12 63.5,71.12 73.03,61.59 U3.24
N$46  (via drill 0.61)
  Top 0.61: v57.15,68.26 63.82,61.59 U3.1
  Bottom 0.61: v57.15,68.26 57.15,73.66 JP3.2
N$47  (via drill 0.61)
  Top 0.61: v60.33,60.33 U3.2
  Bottom 0.61: v60.33,60.33 59.69,60.96 59.69,73.03 58.42,74.3 JP3.4
N$48  (via drill 0.61)
  Top 0.61: v60.33,49.21 63.5,49.21 63.82,48.9 U3.11
  Bottom 0.61: v60.33,49.21 62.23,51.12 62.23,73.66 JP3.6
N$49  (via drill 0.61)
  Top 0.61: v63.82,43.81 62.23,43.81 62.23,46.04 63.82,47.62 U3.12
  Bottom 0.61: v63.82,43.81 64.77,44.77 64.77,73.66 JP3.8
N$50  (via drill 0.61)
  Top 0.61: v63.5,45.09 70.48,45.09 73.03,47.62 U3.13
  Bottom 0.61: JP3.7 v63.5,45.09
N$51  (via drill 0.61)
  Top 0.61: v74.93,45.09 74.93,47.94 74.3,48.58 73.66,48.58 73.34,48.9 U3.14
  Bottom 0.61: v74.93,45.09 65.72,54.29 65.72,74.61 64.14,76.2 59.69,76.2 59.69,74.3 60.96,73.03 JP3.5
N$52
  Top 0.61: JP4.1 73.34,70.17 79.06,70.17 88.58,60.64 94.3,60.64 94.61,60.33 U4.23
N$53
  Top 0.61: JP4.3 74.93,71.12 85.09,71.12 94.61,61.59 U4.24
N$54  (via drill 0.61)
  Top 0.61: v78.74,67.94 79.06,67.94 85.41,61.59 U4.1
  Bottom 0.61: v78.74,67.94 76.2,70.48 JP4.5
N$55
  Top 0.61: JP4.7 77.47,73.66 69.85,73.66 69.85,71.75 80.96,60.64 85.09,60.64 85.41,60.33 U4.2
N$56  (via drill 0.61)
  Top 0.61: v80.01,49.21 85.09,49.21 85.41,48.9 U4.11
  Bottom 0.61: v80.01,49.21 80.01,73.66 JP4.8
N$57  (via drill 0.61)
  Top 0.61: v80.64,47.94 85.09,47.94 85.41,47.62 U4.12
  Bottom 0.61: v80.64,47.94 81.28,48.58 81.28,74.3 79.38,76.2 76.2,76.2 JP4.6
N$58  (via drill 0.61)
  Top 0.61: v97.47,45.09 94.93,47.62 U4.13
  Bottom 0.61: v97.47,45.09 97.47,74.61 93.98,78.11 69.85,78.11 69.85,74.3 70.48,73.66 73.66,73.66 JP4.4
N$59  (via drill 0.61)
  Top 0.61: v82.55,43.5 90.17,43.5 90.81,44.13 91.12,44.13 91.12,46.04 93.66,48.58 94.3,48.58 94.61,48.9 U4.14
  Bottom 0.61: v82.55,43.5 82.23,43.81 82.23,74.61 79.69,77.15 71.12,77.15 JP4.2
N$60  (via drill 0.61)
  Top 0.61: v91.44,41.27 94.93,37.78 95.57,37.78 95.89,37.47 U5.23
  Bottom 0.61: v91.44,41.27 92.71,42.55 JP5.5
N$61  (via drill 0.61)
  Top 0.61: v95.89,43.5 95.89,38.73 U5.24
  Bottom 0.61: v95.89,43.5 94.61,44.77 94.61,71.75 JP5.7
N$62  (via drill 0.61)
  Top 0.61: v95.89,45.09 93.34,45.09 87,38.73 U5.1
  Bottom 0.61: v95.89,45.09 96.52,45.72 96.52,73.66 JP5.8
N$63  (via drill 0.61)
  Top 0.61: v82.23,41.27 85.72,37.78 86.36,37.78 86.68,37.47 U5.2
  Bottom 0.61: v82.23,41.27 84.45,43.5 84.45,74.93 86.68,77.15 92.71,77.15 JP5.6
N$64  (via drill 0.61)
  Top 0.61: v81.92,26.04 U5.11
  Bottom 0.61: v81.92,26.04 85.41,29.53 85.41,74.61 87,76.2 90.17,76.2 JP5.4
N$65  (via drill 0.61)
  Top 0.61: v86.36,22.23 86.68,22.23 86.68,24.77 U5.12
  Bottom 0.61: v86.36,22.23 86.36,73.66 JP5.2
N$66  (via drill 0.61)
  Top 0.61: v88.58,17.78 92.71,17.78 92.71,19.68 93.34,20.32 95.89,20.32 95.89,24.77 U5.13
  Bottom 0.61: v88.58,17.78 87.63,18.73 JP5.1
N$67  (via drill 0.61)
  Top 0.254: v91.76,22.23 94.93,25.4 95.25,25.4 95.89,26.04 U5.14
  Bottom 0.254: v91.76,22.23 90.49,23.5 90.49,72.07 JP5.3
N$68  (via drill 0.61)
  Top 0.254: 61.28,24.13 61.28,25.4 60.64,25.4 59.05,26.99 59.05,27.94 54.61,27.94 54.29,27.62 48.26,27.62 40.01,35.88 34.92,35.88 33.66,37.15 OK3.5 | 61.28,24.13 61.28,21.59 ~G.A | U0.4 11.75,57.78 12.38,58.42 17.78,58.42 18.41,57.78 U1.4 32.07,57.78 32.7,58.42 45.72,58.42 | 45.72,58.42 45.09,57.78 U2.4 | 45.72,58.42 57.15,58.42 57.78,57.78 U3.4 71.44,57.78 72.07,58.42 v78.74,58.42 84.77,58.42 85.41,57.78 U4.4 | v79.38,35.24 86.36,35.24 86.68,34.92 U5.4 | 61.28,24.13 73.98,24.13 v74.3,23.81
  Bottom 0.254: v78.74,58.42 78.74,35.88 v79.38,35.24 79.38,28.89 v74.3,23.81
N$69  (via drill 0.61)
  Top 0.254: v74.3,13.97 61.59,13.97 61.59,11.43 SRCK.A | v74.93,20.32 81.92,27.3 U5.10 | U0.10 11.75,50.16 12.38,50.8 22.23,50.8 22.86,50.16 U1.10 27.3,50.16 | OK3.7 31.11,35.88 29.21,35.88 v27.3,37.78 | 27.3,50.16 v27.3,45.09 | U4.10 75.25,50.16 74.61,50.8 71.75,50.8 71.12,50.16 66.99,50.16 | 66.99,50.16 U3.10 62.23,50.16 61.59,50.8 53.02,50.8 52.39,50.16 U2.10 40.64,50.16 40.01,50.8 32.7,50.8 32.07,50.16 27.3,50.16 | v55.56,41.27 62.55,48.26 65.09,48.26 66.99,50.16
  Bottom 0.254: v74.3,13.97 74.93,14.61 v74.93,20.32 55.56,39.69 v55.56,41.27 | v27.3,45.09 v27.3,37.78
N$70  (via drill 0.61)
  Top 0.254: 61.59,19.05 61.59,16.51 RCK.A | 61.59,19.05 79.06,19.05 85.41,25.4 87.95,25.4 88.27,25.72 88.27,28.57 U5.9 | 23.81,52.07 5.08,52.07 4.45,51.44 U0.9 | 23.81,52.07 24.45,51.44 U1.9 | 44.13,52.07 44.77,51.44 U2.9 | 23.81,52.07 v41.27,52.07 44.13,52.07 | 63.18,52.07 63.82,51.44 U3.9 | 44.13,52.07 63.18,52.07 | 63.18,52.07 84.77,52.07 85.41,51.44 U4.9 | OK2.7 40.01,38.73 44.77,38.73 v45.09,38.42 | 61.59,19.05 59.05,21.59 59.05,23.5 v47.62,23.5
  Bottom 0.254: 44.13,39.37 41.27,42.23 v41.27,52.07 | 44.13,39.37 v45.09,38.42 | v47.62,23.5 44.13,26.99 44.13,39.37
N$71  (via drill 0.61)
  Top 0.254: v53.98,28.57 59.37,28.57 61.28,26.67 ~SRCLR.A | v53.98,35.24 52.07,37.15 51.44,37.15 OK1.5 | U5.3 81.28,36.2 78.74,38.73 v55.24,38.73 | 65.41,59.69 84.77,59.69 85.41,59.05 U4.3 | 65.41,59.69 64.77,59.69 64.14,59.05 U3.3 | 26.04,59.69 26.04,59.05 U1.3 | 26.04,59.69 26.04,60.64 25.72,60.96 23.18,60.96 22.86,61.28 18.41,61.28 16.83,59.69 5.08,59.69 4.45,59.05 U0.3 | 44.13,59.69 44.77,59.05 U2.3 | 26.04,59.69 36.83,59.69 | 36.83,59.69 44.13,59.69 | 65.41,59.69 65.41,60.96 60.96,60.96 60.64,61.28 58.74,61.28 57.15,59.69 44.13,59.69 | v54.29,65.41 53.02,64.14 37.78,64.14 36.83,63.18 36.83,59.69
  Bottom 0.254: v53.98,28.57 v53.98,35.24 53.98,37.47 v55.24,38.73 54.29,39.69 v54.29,65.41
N$72
  Top 0.254: OK4.2 20.95,30.48 20.32,29.84 18.73,29.84 18.73,19.37 19.05,19.05 30.16,19.05 31.43,20.32 R13.1
N$73  (via drill 0.61)
  Top 0.254: v55.24,31.75 SHIFT.C | v54.61,9.84 52.39,7.62 R1.2
  Bottom 0.254: v55.24,31.75 56.2,30.8 56.2,11.43 v54.61,9.84
N$74  (via drill 0.61)
  Top 0.254: SRCK.C 41.59,11.43 v41.27,11.75 | v38.73,9.21 37.15,7.62 R4.2
  Bottom 0.254: v38.73,9.21 v41.27,11.75
N$75
  Top 0.254: ~G.C 58.1,21.59 58.1,17.78 58.74,17.78 59.05,17.46 59.05,13.34 51.44,13.34 50.8,12.7 35.88,12.7 34.61,13.97 R6.2
N$76  (via drill 0.61)
  Top 0.254: v20.95,23.5 20.32,23.5 20.32,20.32 R11.1 | v27.3,29.84 30.48,29.84 31.11,30.48 OK3.2
  Bottom 0.254: v27.3,29.84 v20.95,23.5
N$77  (via drill 0.61)
  Top 0.254: v6.67,23.5 5.08,23.5 5.08,20.32 R10.1 | v27.3,32.38 28.26,33.34 38.73,33.34 40.01,32.07 OK2.2
  Bottom 0.254: v6.67,23.5 7.3,22.86 18.1,22.86 18.1,23.18 v27.3,32.38
N$78  (via drill 0.61)
  Top 0.254: v6.67,10.79 5.08,10.79 5.08,13.97 R9.1 | v54.93,30.48 54.29,31.11 51.44,31.11 OK1.4
  Bottom 0.254: v6.67,10.79 14.92,10.79 14.92,6.03 15.56,5.4 50.48,5.4 50.48,26.35 52.07,27.94 53.34,27.94 53.66,27.62 54.93,27.62 v54.93,30.48
N$79
  Top 0.254: SER-IN.C 24.45,6.35 23.18,7.62 R7.2
N$80
  Top 0.254: POWER.C 20.95,26.67 22.23,27.94 26.67,27.94 27.94,26.67 R14.2
VCC  (via drill 0.61)
  Top 0.254: 33.02,57.15 14.29,57.15 13.65,57.78 U0.21 | 33.02,57.15 33.66,57.78 U1.21 | 53.34,57.15 53.98,57.78 U2.21 | 33.02,57.15 40.32,57.15 | 40.32,57.15 53.34,57.15 | 72.39,57.15 73.03,57.78 U3.21 | 53.34,57.15 72.39,57.15 | 72.39,57.15 93.98,57.15 94.61,57.78 U4.21 | OK3.8 29.84,38.73 31.75,38.73 | 31.75,38.73 32.38,38.1 OK3.6 32.38,35.24 19.68,35.24 | 38.1,38.1 37.47,38.73 31.75,38.73 | 38.1,38.1 38.73,37.47 OK2.8 | 17.46,34.29 17.46,26.67 POWER.A | 17.46,34.29 19.37,34.29 19.68,34.61 19.68,35.24 | OK4.8 19.68,35.24 | 17.46,34.29 9.53,34.29 7.62,32.38 X1.1 | 50.8,35.88 50.16,36.51 OK1.6 | 50.8,35.88 52.39,34.29 95.25,34.29 95.89,34.92 U5.21 | 50.8,35.88 47.62,35.88 OK1.8 47.62,37.47 45.72,39.37 40.32,39.37 | 38.1,38.1 39.37,39.37 40.32,39.37 | v40.32,55.24 40.32,57.15 | 40.32,39.37 v40.32,40.01
  Bottom 0.254: v40.32,40.01 v40.32,55.24

### Text on the board
Top: GND | 5V | Shift | PWR 5V | ~SRCLR | ~G | RCK | SRCK | Input | S-IN | Chris Gregg | Kate Wasynczuk | V.2 May 2015